# EAGLE design ESP32_CLOCK_v1 (EAGLE 9.2.0)
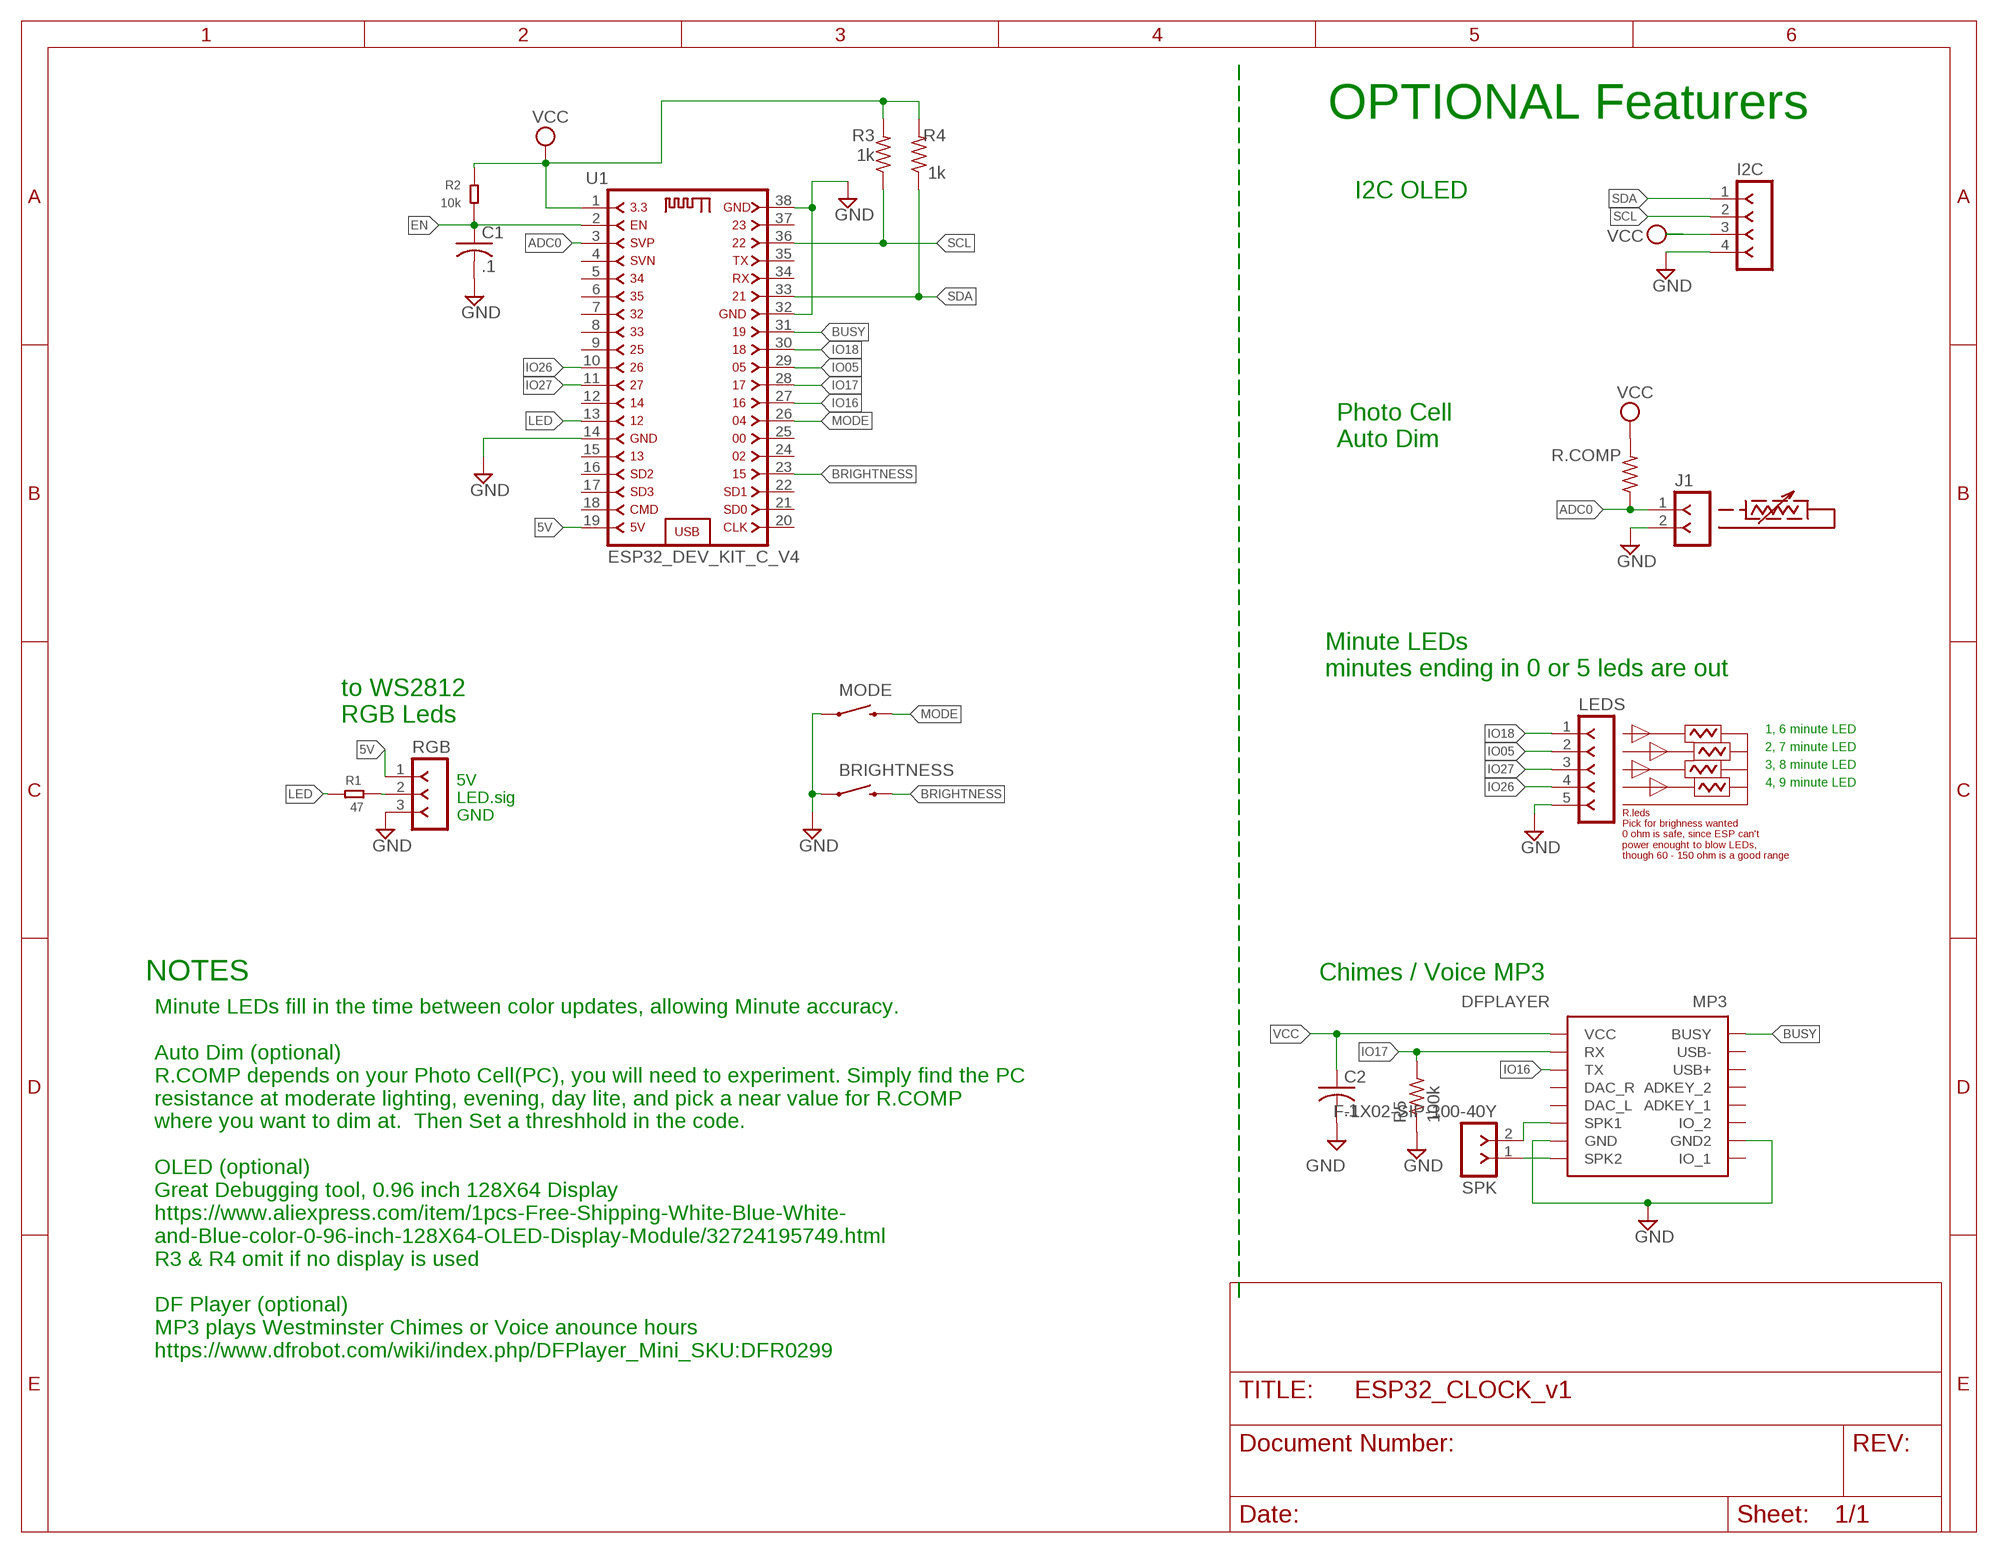
[diagram p0: schematic, sheet 1]

## Parts
BRIGHTNESS  SWITCH-MOMENTARY-2SIDE_EZ  [TACTILE-PTH-SIDEEZ]
C1  .1  C-USC0805K  [C0805K]
C2  .1  C-USC0805K  [C0805K]
I2C  F-1X04-SIP-100-40Y  [SIP-100-04-40Y]
J1  F-1X02-SIP-100-40Y  [SIP-100-02-40Y]
LEDS  F-1X05-SIP-100-40Y  [SIP-100-05-40Y]
MODE  SWITCH-MOMENTARY-2SIDE_EZ  [TACTILE-PTH-SIDEEZ]
MP3  DFPLAYER  [DFPLAYER]
R1  47  R-0805  [R0805]
R2  10k  R-0805  [R0805]
R3  1k  R-US_M0805  [M0805]
R4  1k  R-US_M0805  [M0805]
R5  100k  R-US_M0805  [M0805]
R.COMP  R-US_M0805  [M0805]
RGB  F-1X03-SIP-100-40Y  [SIP-100-03-40Y]
SPK  F-1X02-SIP-100-40Y  [SIP-100-02-40Y]
U1  ESP32_DEV_KIT_C_V4  [ESP32_DEV_KIT_C_V4]

## Nets
5V: RGB.1 U1.19
ADC0: J1.1 R.COMP.1 U1.3
BRIGHTNESS: BRIGHTNESS.2 U1.23
BUSY: MP3.BUSY U1.31
EN: C1.1 R2.1 U1.2
GND: BRIGHTNESS.1 C1.2 C2.2 I2C.4 J1.2 LEDS.5 MODE.1 MP3.GND MP3.GND2 R5.1 RGB.3 U1.14 U1.32 U1.38
IO05: LEDS.2 U1.29
IO16: MP3.TX U1.27
IO17: MP3.RX R5.2 U1.28
IO18: LEDS.1 U1.30
IO26: LEDS.4 U1.10
IO27: LEDS.3 U1.11
LED: R1.2 U1.13
MODE: MODE.2 U1.26
N$1: MP3.SPK2 SPK.1
N$4: MP3.SPK1 SPK.2
N$5: R1.1 RGB.2
SCL: I2C.2 R3.1 U1.36
SDA: I2C.1 R4.1 U1.33
VCC: C2.1 I2C.3 MP3.VCC R2.2 R3.2 R4.2 R.COMP.2 U1.1
Unconnected: MP3.ADKEY_1 MP3.ADKEY_2 MP3.DAC_L MP3.DAC_R MP3.IO1(IO_1) MP3.IO_2 MP3.USB+ MP3.USB- U1.4 U1.5 U1.6 U1.7 U1.8 U1.9 U1.12 U1.15 U1.16 U1.17 U1.18 U1.20 U1.21 U1.22 U1.24 U1.25 U1.34 U1.35 U1.37

## Notes on the sheet
- OPTIONAL Featurers
- I2C OLED
- Photo Cell
  Auto Dim
- Minute LEDs
  minutes ending in 0 or 5 leds are out
- to WS2812
  RGB Leds
- 1, 6 minute LED
- 2, 7 minute LED
- 3, 8 minute LED
- 4, 9 minute LED
- 5V
  LED.sig
  GND
- R.leds
  Pick for brighness wanted
  0 ohm is safe, since ESP can't
  power enought to blow LEDs,
  though 60 - 150 ohm is a good range
- NOTES | Chimes / Voice MP3
- Minute LEDs fill in the time between color updates, allowing Minute accuracy.
  
  Auto Dim (optional)
  R.COMP depends on your Photo Cell(PC), you will need to experiment. Simply find the PC
  resistance at moderate lighting, evening, day lite, and pick a near value for R.COMP 
  where you want to dim at.  Then Set a threshhold in the code.
  
  OLED (optional)
  Great Debugging tool, 0.96 inch 128X64 Display
  https://www.aliexpress.com/item/1pcs-Free-Shipping-White-Blue-White-
  and-Blue-color-0-96-inch-128X64-OLED-Display-Module/32724195749.html
  R3 & R4 omit if no display is used 
  
  DF Player (optional)
  MP3 plays Westminster Chimes or Voice anounce hours
  https://www.dfrobot.com/wiki/index.php/DFPlayer_Mini_SKU:DFR0299

## Library data of the parts
BRIGHTNESS MODE = SparkFun-Electromechanical:SWITCH-MOMENTARY-2: Various NO switches- pushbuttons, reed, etc
C1 C2 = rcl:C-US: CAPACITOR, American symbol; SPICEPREFIX: C
I2C = con-headers-jp:F-1X04-: FEMALE HEADER
J1 SPK = con-headers-jp:F-1X02-: FEMALE HEADER
LEDS = con-headers-jp:F-1X05-: FEMALE HEADER
MP3 = My_Lib:DFPLAYER: DFPlayer Mini MP3 Player with an simplified output directly to the speaker. Module work be stand alone with attached battery, speaker and push buttons Specification - sampling rates (kHz): 8/11.025/12/16/22.05/24/32/44.1/48 - 24 -bit DAC, dynamic range 90dB , SNR support 85dB - FAT16 , FAT32 SD, max 32G TF card, 32G U disk, 64M bytes NORFLASH - 3 control modes, I/O control mode, serial mode, AD button control mode - advertising sound waiting function, the music can be suspended. when advertising is over in the music continue to play - audio data sorted by folder, up to 100 folders, every folder can hold up to 255 songs - 30 level adjustable volume, 6 -level EQ adjustable
R1 R2 = discrete:R*
R3-R5 R.COMP = rcl:R-US_: RESISTOR, American symbol; SPICEPREFIX: R
RGB = con-headers-jp:F-1X03-: FEMALE HEADER
U1 = My_Lib:ESP32_DEV_KIT_C_V4: ESP32_DEV_KIT_C_V4 ESP32 Dev Module

## Board
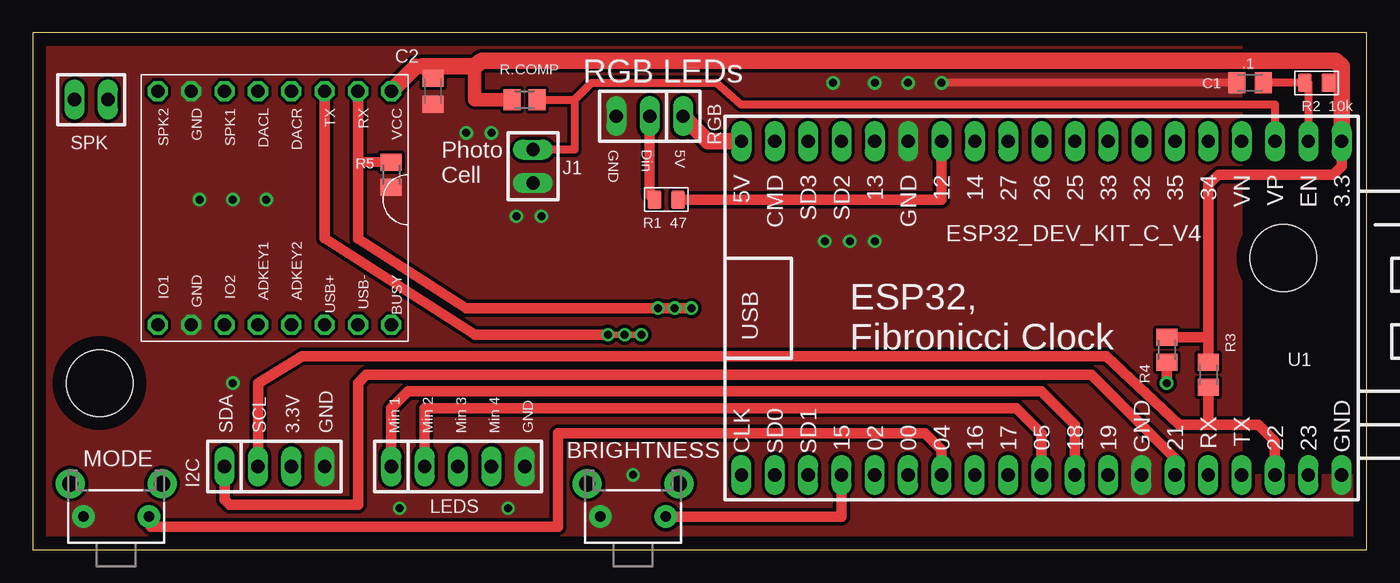
[diagram p1: board, top side]
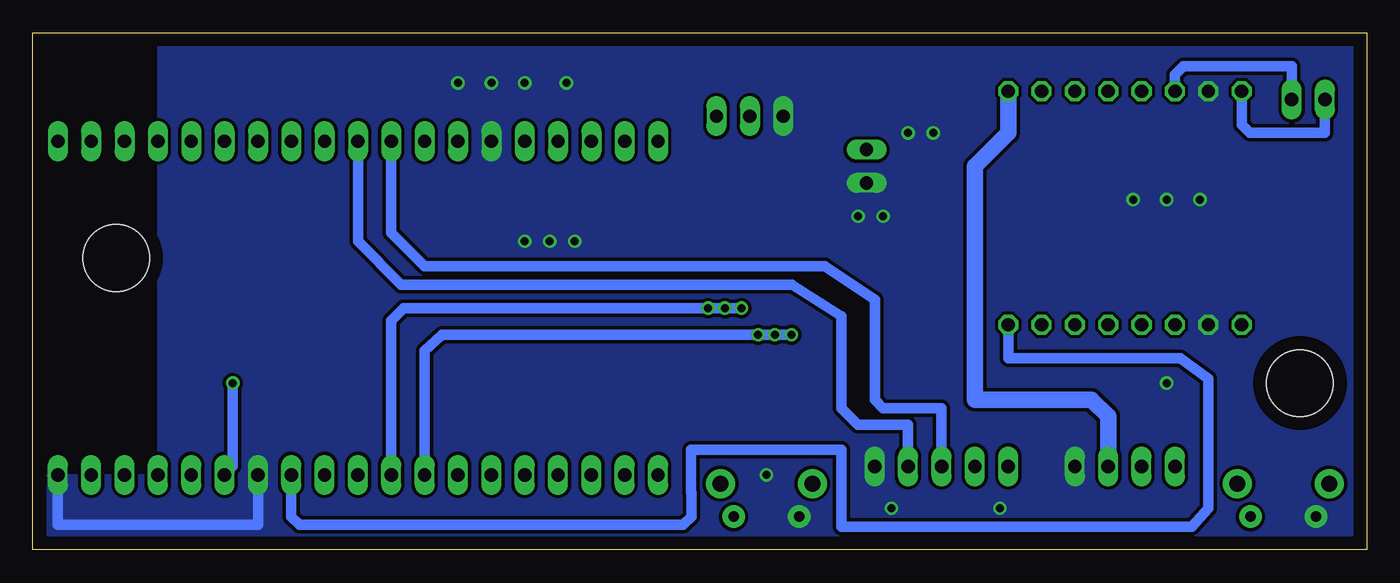
[diagram p2: board, bottom side, seen from below]

Size 101.6 x 39.37 mm. Coordinates in mm from the lower left corner, seen from the top.
Outline: 0,0 101.6,0 101.6,39.37 0,39.37 0,0
Copper layers (1*16): Top 0.035mm / dielectric 1.5mm / Bottom 0.035mm
Design rules "default *": minimum track width 10mil, minimum drill 24mil, track to track 10mil, track to pad 10mil, pad to pad 10mil, via to via 10mil, smd to smd 10mil, copper to edge 40mil, drill to drill 8mil, minimum pad ring 10mil, minimum via ring 8mil, stop-mask expansion 4mil, vias tented up to drill 0mil, thermal gap 0mil
Holes 5.08 mm at 5.08,12.7 95.25,22.23
tRestrict: area -14.4,-133.8 to -10.7,-130.1; area -41.3,-109 to -38.2,-106.5; area -38.4,-111.8 to -28.4,-106.8; area -31.4,-136.5 to -28.5,-132.3; area -39.8,-125.3 to -37.8,-123; area -24.5,-130.9 to -22.6,-129.5; area -29.7,-130 to -26.7,-128.5; area -11.4,-108.8 to -6.4,-106.5; area -23.7,-108.7 to -11.2,-106.5; area -23.4,-127.6 to -6.5,-125.2; area -25.3,-123.7 to -22.9,-111.9; area -25.7,-135.5 to -22.2,-130.8; 23 more areas
bRestrict: area -43.6,-109 to -40.8,-106.6; area -38.5,-111.6 to -28.2,-106.7; area -41,-109 to -38.2,-106.6; area -43.7,-111.7 to -41.2,-108.9; area -40.1,-132.5 to -35.8,-130.8

### Footprints (pad centres in the part's own frame; a part is rotated, then mirrored left to right if it is on the bottom)
TACTILE-PTH-SIDEEZ = drill 0.8 pad 1.7: 1 -2.5,0; 2 2.5,0 | drill 1.2 pad 2.2: ANCHOR1 -3.5,2.5; ANCHOR2 3.5,2.5
C0805K = smd 1.3 x 1.6: 1 -1,0; 2 1,0
SIP-100-04-40Y = drill 1.016 long: 1 -3.81,0; 2 -1.27,0; 3 1.27,0; 4 3.81,0
SIP-100-02-40Y = drill 1.016 long: 1 -1.27,0; 2 1.27,0
SIP-100-05-40Y = drill 1.016 long: 1 -5.08,0; 2 -2.54,0; 3 0,0; 4 2.54,0; 5 5.08,0
DFPLAYER = drill 1.016 octagon: ADKEY_1 7.62,-1.27; ADKEY_2 7.62,1.27; BUSY 7.62,8.89; DAC_L -10.16,-1.27; DAC_R -10.16,1.27; GND -10.16,-6.35; GND2 7.62,-6.35; IO1 7.62,-8.89; IO_2 7.62,-3.81; RX -10.16,6.35; SPK1 -10.16,-3.81; SPK2 -10.16,-8.89; TX -10.16,3.81; USB+ 7.62,3.81; USB- 7.62,6.35; VCC -10.16,8.89
R0805 = smd 1.016 x 1.397: 1 -0.889,0; 2 0.889,0
M0805 = smd 1.3 x 1.6: 1 -0.95,0; 2 0.95,0
SIP-100-03-40Y = drill 1.016 long: 1 -2.54,0; 2 0,0; 3 2.54,0
ESP32_DEV_KIT_C_V4 = drill 1.016 long: 1 -12.7,24.13; 2 -12.7,21.59; 3 -12.7,19.05; 4 -12.7,16.51; 5 -12.7,13.97; 6 -12.7,11.43; 7 -12.7,8.89; 8 -12.7,6.35; 9 -12.7,3.81; 10 -12.7,1.27; 11 -12.7,-1.27; 12 -12.7,-3.81; 13 -12.7,-6.35; 14 -12.7,-8.89; 15 -12.7,-11.43; 16 -12.7,-13.97; 17 -12.7,-16.51; 18 -12.7,-19.05; 19 -12.7,-21.59; 20 12.7,-19.05; 21 12.7,-21.59; 22 12.7,-16.51; 23 12.7,-13.97; 24 12.7,-11.43; 25 12.7,-8.89; 26 12.7,-6.35; 27 12.7,-3.81; 28 12.7,-1.27; 29 12.7,1.27; 30 12.7,3.81; 31 12.7,6.35; 32 12.7,8.89; 33 12.7,11.43; 34 12.7,13.97; 35 12.7,16.51; 36 12.7,19.05; 37 12.7,21.59; 38 12.7,24.13

### Placement (x,y rotation side)
BRIGHTNESS  45.72,2.54 0 top
C1  92.71,35.56 180 top
C2  30.48,34.92 270 top
I2C  18.41,6.35 0 top
J1  38.1,29.21 270 top
LEDS  32.38,6.35 0 top
MODE  6.35,2.54 0 top
MP3  18.41,24.77 270 top
R1  48.26,26.67 0 top
R2  97.79,35.56 0 top
R3  89.53,13.34 90 top
R4  86.36,15.24 90 top
R5  27.3,28.57 90 top
R.COMP  37.47,34.29 180 top
RGB  46.99,33.02 180 top
SPK  4.45,34.29 0 top
U1  75.56,18.41 270 top

### Tracks (layer width: path | path; a pad name or v marks a point on that pad's centre or on a via)
5V
  Top 1.27: U1.19 51.44,31.11 RGB.1
ADC0
  Top 0.61: 41.27,34.29 41.27,30.48 J1.1 | 41.27,34.29 42.55,35.56 52.07,35.56 53.98,33.91 94.61,33.91 U1.3 | R.COMP.1 41.27,34.29
BRIGHTNESS
  Top 0.813: BRIGHTNESS.2 51.44,2.54 61.59,2.54 U1.23
BUSY
  Bottom 0.508: 51.44,4.35 51.46,4.37
  Bottom 0.813: U1.31 81.92,2.54 81.28,1.91 52.07,1.91 51.44,2.54 51.44,4.35 | 51.46,4.37 51.46,7.62 49.89,7.62 40.92,7.62 40.01,7.62 40.01,3.78 40.01,1.78 13.34,1.78 12.06,3.17 12.06,13.02 14.18,14.61 19.68,14.61 27.3,14.61 MP3.BUSY
EN
  Top 0.508: 97.16,35.54 R2.1
  Top 0.61: 97.16,35.54 U1.2 | R2.1 C1.1
GND  (via drill 0.61)
  Top 0.61: C1.2 v69.22,35.56
  Bottom 0.813: U1.38 99.69,1.91 84.45,1.91 U1.32
  other vias: 60.33,23.5 62.23,23.5 36.2,3.17 64.14,23.5 15.24,26.67 27.94,3.17 15.24,12.7 12.7,26.67 33.02,31.75 36.83,25.4 38.73,25.4 45.72,5.71 34.92,31.75 17.78,26.67 60.96,35.56 64.14,35.56 66.67,35.56
  pour Bottom (isolate 0.254): 100.97,-5.08 100.97,5.71 92.08,5.71 92.08,41.91 -3.17,41.91 -3.17,-5.08
  pour Top: 100.97,-5.71 100.97,5.71 92.08,5.71 92.08,43.18 -4.45,43.18 -4.45,-5.71
IO05
  Top 0.813: LEDS.2 29.84,10.79 74.93,10.79 76.83,8.89 U1.29
IO16  (via drill 0.61)
  Top 0.508: v43.81,16.38 v45.09,16.38 v46.35,16.38
  Top 0.813: v43.81,16.38 33.7,16.38 22.23,23.72 MP3.TX
  Bottom 0.813: U1.27 71.75,15.18 70.41,16.38 v43.81,16.38
IO17  (via drill 0.61)
  Top 0.508: v47.62,18.41 v48.9,18.41
  Top 0.813: v50.16,18.41 v48.9,18.41 33.02,18.41 24.77,23.7 24.77,29.57 | 24.77,29.57 MP3.RX | R5.2 24.77,29.57
  Bottom 0.813: U1.28 74.3,17.46 73.34,18.41 v47.62,18.41
IO18
  Top 0.813: U1.30 79.38,9.53 76.83,12.06 28.57,12.06 27.3,10.79 LEDS.1
IO26
  Bottom 0.813: LEDS.4 34.92,8.26 34.92,9.53 38.73,9.53 40.01,10.79 40.01,17.78 43.76,20.19 73.53,20.19 76.83,23.5 U1.10
IO27
  Bottom 0.813: U1.11 74.3,24.13 71.75,21.59 41.27,21.59 37.47,19.05 37.47,11.43 36.83,10.79 32.38,10.79 32.38,9.53 LEDS.3
LED
  Top 0.813: R1.2 51.44,26.67 69.22,26.67 U1.13
MODE
  Top 0.61: MODE.2 8.98,1.78
  Top 0.813: U1.26 69.22,7.62 67.94,8.89 40.01,8.89 40.01,1.78 8.98,1.78
N$1
  Bottom 0.813: SPK.1 3.17,31.75 8.89,31.75 9.53,32.38 MP3.SPK2
N$4
  Bottom 0.813: SPK.2 5.71,36.83 13.97,36.83 14.61,36.2 MP3.SPK1
N$5
  Top 0.813: RGB.2 46.99,27.3 47.02,27.02 R1.1
SCL
  Top 0.813: U1.36 94.61,8.26 93.34,9.53 90.12,9.53 | 90.12,9.53 87.31,9.53 81.79,14.73 20.53,14.73 17.14,12.7 I2C.2 | 90.12,9.53 89.53,9.53 | 90.12,9.53 89.53,9.91 R3.1
SDA  (via drill 0.61)
  Top 0.813: I2C.1 14.61,3.81 14.99,3.43 24.77,3.43 24.77,12.7 25.4,13.34 80.64,13.34 87,6.99 U1.33 | R4.1 v86.36,12.7
  Bottom 0.813: v86.36,12.7 86.36,6.35 U1.33
VCC
  Top 0.254: 99.69,36.83 99.69,36.2 99.31,36.2 R2.2
  Top 0.508: 30.48,36.83 C2.1
  Top 0.813: 89.53,16.19 R3.2 | 89.53,16.19 89.53,27.84 90.33,28.57 99.06,28.57 99.69,29.21 U1.1 | 89.53,16.19 R4.2
  Top 1.016: 33.66,36.83 33.66,34.29 R.COMP.2 | 29.16,36.78 29.64,36.83
  Top 1.27: U1.1 99.69,36.83 99.26,37.26 34.17,37.26 33.66,36.83 30.48,36.83 29.64,36.83 | MP3.VCC 29.16,36.78
  Bottom 1.27: I2C.3 19.68,10.16 20.95,11.43 29.84,11.43 29.84,29.21 27.3,31.75 MP3.VCC

### Text on the board
tPlace: RGB LEDs | GND | Din | 5V | Photo / Cell | ESP32, / Fibronicci Clock | SDA | SCL | 3.3V | GND | Min 1 | Min 2 | Min 3 | Min 4 | GND
Measures: PCB thickness to be .8mm / .031 in. / / .144 holes for #6 screws, x2 / .118 holes for mounting alignment, x3 / / Mounting and Alignment holes, 0.142, 0.118, .035 are not plated / / Corners .1" offset for 45 degree, left out to avoid dimention cltter / / All Dementions in inches | 2 alignment holes, .12/(3mm)
_tsilk: Ver 5.1.2